# Altium project STM32F7_BaseBoard.PrjPcb
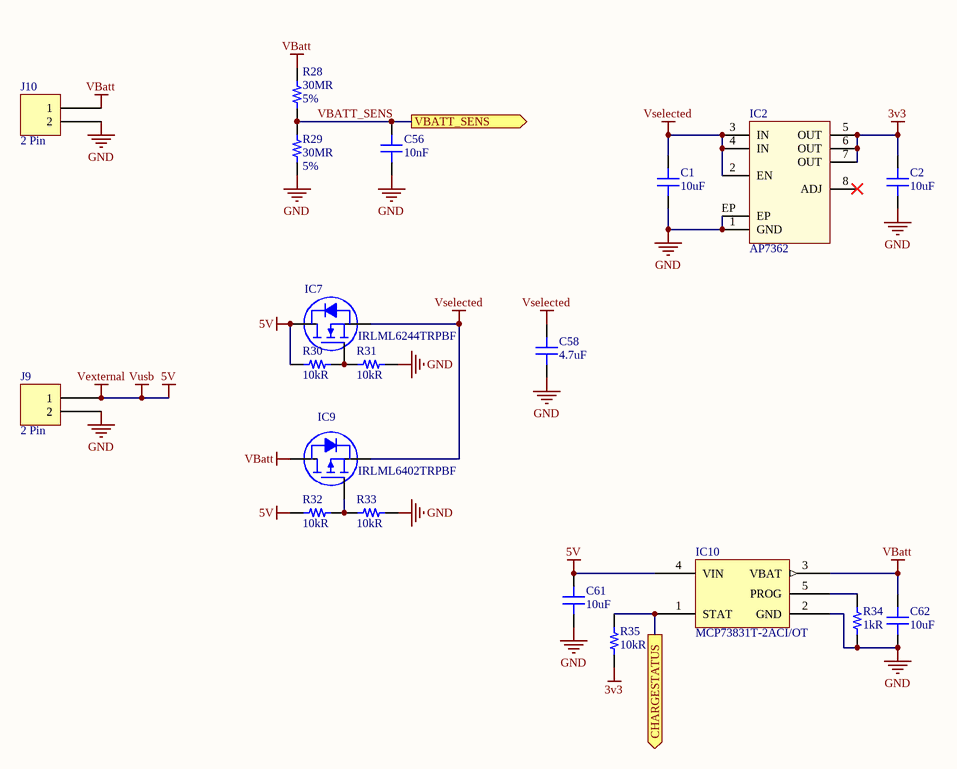
[diagram p0: Power.SchDoc]
6 sheets, 41 parts. Net scope: flat (ports and power ports of the same name join across sheets).
Board file: STM32F7_CoreBoard.PcbDoc
Sheets:
  Power.SchDoc
  QSPI FLASH.SchDoc
  Paralel NOR FLASH.SchDoc
  LCD.SchDoc
  Camera.SchDoc
  Connections.SchDoc

## Sheet Power.SchDoc: Power
size A4; SheetSize: A4

### Parts
C1  10uF  [CAP 0603/1608]
C2  10uF  [CAP 0603/1608]
C56  10nF  [CAP 0603/1608]
C58  4.7uF  [CAP 0603/1608]
C61  10uF  [CAP 0603/1608]
C62  10uF  [CAP 0603/1608]
IC2  AP7362  [DIODES SO-8-EP]
IC7  IRLML6244TRPBF  [INFINEON SOT-23-3]
IC9  IRLML6402TRPBF  [INFINEON SOT-23-3]
IC10  MCP73831T-2ACI/OT  [MICROCHIP SOT-23-5 OT]
J9  2 Pin  [JST XH B2B-XH-A]
J10  2 Pin  [JST XH B2B-XH-A]
R28  30MR  Tolerance: 5%  [RES 0603/1608]
R29  30MR  Tolerance: 5%  [RES 0603/1608]
R30  10kR  [RES 0603/1608]
R31  10kR  [RES 0603/1608]
R32  10kR  [RES 0603/1608]
R33  10kR  [RES 0603/1608]
R34  1kR  [RES 0603/1608]
R35  10kR  [RES 0603/1608]

### Ports
CHARGESTATUS (out), VBATT_SENS (out)

### Nets
3v3: C2.2 IC2.5(OUT) IC2.6(OUT) IC2.7(OUT) R35.1
5V: C61.2 IC7.3(D) IC10.4(VIN) J9.1 R30.2 R32.2  [also labelled Vexternal, Vusb]
GND: C1.1 C2.1 C56.1 C58.1 C61.1 C62.1 IC2.1(GND) IC2.EP IC10.2(GND) J9.2 J10.2 R29.1 R31.1 R33.1 R34.1
VBatt: C62.2 IC9.3(D) IC10.3(VBAT) J10.1 R28.2
Vselected: C1.2 C58.2 IC2.2(EN) IC2.3(IN) IC2.4(IN) IC7.2(S) IC9.2(S)
VBATT_SENS: C56.2 R28.1 R29.2 ; port VBATT_SENS
NetIC7_1: IC7.1(G) R30.1 R31.2
NetIC9_1: IC9.1(G) R32.1 R33.2
NetIC10_1: IC10.1(STAT) R35.2 ; port CHARGESTATUS
NetIC10_5: IC10.5(PROG) R34.2

Not connected (* = marked no-connect by the designer): IC2 8(ADJ)*

### Notes on the sheet
- Title:
- Size:
- Project:
- Revision:
- Sheet
- of
- Date:
- YıLDıZ IoT
- Elperek Mahallesi
- Saray Sokak, No:12
- SAKARYA / TURKEY
- File:

### Library data of the parts
C1 C2 C61 C62 = Capacitor - Ceramic: Ceramic, SMT Capacitor; Manufacturer: Samsung; Manufacturer Part Number: CL10A106MQ8NNNC; Tolerance: 20%; Voltage Rating: 6.3V; Dielectric: X5R; Supplier 1: Digi-Key; Supplier Part Number 1: 1276-1119-1-ND; Stock 1: 4408315; Pricing 1: 1 = 0,15000, 10 = 0,11000, 100 = 0,05150, 500 = 0,03614, 1000 = 0,02992 (USD); RoHS: Yes; Mount: Surface Mount; Case/Package: 0603; Case Code (Metric): 1608; Case Code (Imperial): 0603; Contact Plating: Tin; Min Operating Temperature: -55°C; Max Operating Temperature: 85°C; Package Quantity: 1; Packaging: Tape and Reel; Capacitance: 10uF; Voltage: 6.3V; Length: 1.6mm; Height: 0.8mm; Width: 0.031inch; Thickness: 0.035inch; Depth: 0.8mm; Radiation Hardening: No; ComponentLink1URL: https://datasheet.ciiva.com/25798/cl10a106mq8nnnc-25798320.pdf?src-supplier=Digi-Key; ComponentLink1Description: https://datasheet.ciiva.com/25798/cl10a106mq8nnnc-25798320.pdf?src-supplier=Digi-Key; ComponentLink2URL: https://datasheet.ciiva.com/26838/getdatasheetpartid-357557-26838347.pdf?src-supplier=Verical; ComponentLink2Description: https://datasheet.ciiva.com/26838/getdatasheetpartid-357557-26838347.pdf?src-supplier=Verical; ComponentLink3URL: https://datasheet.ciiva.com/16437/cl05b104kq5nnnc-16437327.pdf?src-supplier=Future+Electronics; ComponentLink3Description: https://datasheet.ciiva.com/16437/cl05b104kq5nnnc-16437327.pdf?src-supplier=Future+Electronics
C56 = Capacitor - Ceramic: Ceramic, SMT Capacitor; Manufacturer: KEMET; Manufacturer Part Number: C0603C103J5RACTU; Dielectric: X7R; Tolerance: 5%; Supplier 1: Digi-Key; Supplier Part Number 1: 399-1092-1-ND; Stock 1: 659548; Pricing 1: 1 = 0,10000, 10 = 0,05300, 100 = 0,02360, 500 = 0,01682, 1000 = 0,01322 (USD); RoHS: Yes; Mount: Surface Mount; Case/Package: 0603; Min Operating Temperature: -55°C; Max Operating Temperature: 125°C; Capacitance: 10nF; Packaging: Tape and Reel; Length: 1.6mm; Height: 0.8mm; Depth: 0.8mm; Radiation Hardening: No; ComponentLink1URL: https://datasheet.ciiva.com/22749/kem-c1002-x7r-smd-22749720.pdf?src-supplier=Element14; ComponentLink1Description: https://datasheet.ciiva.com/22749/kem-c1002-x7r-smd-22749720.pdf?src-supplier=Element14; ComponentLink2URL: https://datasheet.ciiva.com/26847/getdatasheetpartid-317400-26847516.pdf?src-supplier=Verical; ComponentLink2Description: https://datasheet.ciiva.com/26847/getdatasheetpartid-317400-26847516.pdf?src-supplier=Verical
C58 = Capacitor - Ceramic: Ceramic, SMT Capacitor; Manufacturer: Samsung; Manufacturer Part Number: CL10A475MQ8NNNC; Tolerance: 20%; Voltage Rating: 6.3V; Dielectric: X5R; Supplier 1: Digi-Key; Supplier Part Number 1: 1276-1907-1-ND; Stock 1: 764729; Pricing 1: 1 = 0,10000, 10 = 0,06300, 100 = 0,02790, 500 = 0,01990, 1000 = 0,01564 (USD); RoHS: Yes; Mount: Surface Mount; Case/Package: 0603; Case Code (Metric): 1608; Case Code (Imperial): 0603; Min Operating Temperature: -55°C; Max Operating Temperature: 85°C; Capacitance: 4.7uF; Packaging: Tape and Reel; Package Quantity: 4000; Voltage Rating (DC): 6.3V; Length: 1.6mm; Height: 0.8mm; Width: 0.031inch; Thickness: 0.035inch; Depth: 0.8mm; Radiation Hardening: No; Lead Free: Lead Free; ComponentLink1URL: https://datasheet.ciiva.com/25713/cl10a475mq8nnnc-25713301.pdf?src-supplier=Digi-Key; ComponentLink1Description: https://datasheet.ciiva.com/25713/cl10a475mq8nnnc-25713301.pdf?src-supplier=Digi-Key; ComponentLink2URL: https://datasheet.ciiva.com/26838/getdatasheetpartid-358407-26838391.pdf?src-supplier=Verical; ComponentLink2Description: https://datasheet.ciiva.com/26838/getdatasheetpartid-358407-26838391.pdf?src-supplier=Verical; ComponentLink3URL: https://datasheet.ciiva.com/16437/cl05b104kq5nnnc-16437323.pdf?src-supplier=Future+Electronics; ComponentLink3Description: https://datasheet.ciiva.com/16437/cl05b104kq5nnnc-16437323.pdf?src-supplier=Future+Electronics
IC2 = DIODES AP7362: The AP7362 is a 1.5A adjustable output voltage linear regulator with ultra-low dropout.; Manufacturer: Diodes; Manufacturer Part Number: AP7362-33SP-13; Output Voltage: 3.3V; Number of Regulators: 1; Output Type: Fixed; Polarity: Positive; Accuracy: 3.5%; Quiescent Current: 25nA; Min Input Voltage: 2.2V; Max Input Voltage: 5.5V; Supplier 1: Digi-Key; Supplier Part Number 1: AP7362-33SP-13DICT-ND; Stock 1: 2958; Pricing 1: 1 = 0,51000, 10 = 0,43600, 25 = 0,40640, 100 = 0,30200, 250 = 0,25552, 500 = 0,24392, 1000 = 0,18003 (USD); RoHS: Yes; Mount: Surface Mount; Case/Package: SOP; Number of Pins: 8; Contact Plating: Tin; Min Operating Temperature: -40°C; Max Operating Temperature: 85°C; Packaging: Tape and Reel; Output Current: 1.5A; Number of Outputs: 1; Max Output Current: 1.5A; ComponentLink1URL: http://www.mouser.com/ds/2/115/AP7362-476331.pdf?src-supplier=Mouser; ComponentLink1Description: http://www.mouser.com/ds/2/115/AP7362-476331.pdf?src-supplier=Mouser; ComponentLink2URL: https://www.diodes.com/assets/Datasheets/AP7362.pdf?src-supplier=Digi-Key; ComponentLink2Description: https://www.diodes.com/assets/Datasheets/AP7362.pdf?src-supplier=Digi-Key; ComponentLink3URL: http://diodes.com/datasheets/AP7362.pdf?src-supplier=Avnet; ComponentLink3Description: http://diodes.com/datasheets/AP7362.pdf?src-supplier=Avnet
IC7 = IRLML6244TRPBF: MOSFET N-CH 20V 6.3A SOT-23; Manufacturer: International Rectifier; Threshold Voltage: 900mV; Rds On Max: 21mR; Input Capacitance: 700pF; Max Power Dissipation: 1.3W; Gate to Source Voltage (Vgs): 12V; Turn-On Delay Time: 4.9ns; Turn-Off Delay Time: 19ns; Fall Time: 12ns; Rise Time: 7.5ns; Recovery Time: 18ns; Number of Elements: 1; Element Configuration: Single; On-State Resistance: 27MR; ComponentLink1Description: Datasheet; ComponentLink1URL: https://www.infineon.com/dgdl/irlml6244pbf.pdf?fileId=5546d462533600a4015356686fed261f; ComponentLink2Description: DigiKey Link; ComponentLink2URL: http://digikey.com/product-detail/en/infineon-technologies/IRLML6244TRPBF/IRLML6244TRPBFCT-ND/2393877; Supplier 1: Digi-Key; Supplier Part Number 1: IRLML6244TRPBFCT-ND; Manufacturer Part Number: IRLML6244TRPBF; Stock 1: 35650; Pricing 1: 1 = 0,36000, 10 = 0,29400, 25 = 0,26880, 100 = 0,16880, 250 = 0,16688, 500 = 0,15626, 1000 = 0,10625 (USD); RoHS: Yes; Mount: Surface Mount; Case/Package: SOT-23; Number of Pins: 3; Min Operating Temperature: -55°C; Max Operating Temperature: 150°C; Continuous Drain Current (ID): 6.3A; Packaging: Tape and Reel; Drain to Source Voltage (Vdss): 20V; Drain to Source Breakdown Voltage: 20V; Package Quantity: 3000; Drain to Source Resistance: 21mR; Power Dissipation: 1.3W; Nominal Vgs: 12V; Length: 3.04mm; Height: 1.02mm; Width: 1.4mm; Radiation Hardening: No; Lead Free: Lead Free; REACH SVHC: No SVHC; ComponentLink3URL: https://datasheet.ciiva.com/7935/irlml6244pbf-7935686.pdf?src-supplier=Element14; ComponentLink3Description: https://datasheet.ciiva.com/7935/irlml6244pbf-7935686.pdf?src-supplier=Element14; ComponentLink4URL: https://datasheet.ciiva.com/6369/irlml6244pbf-6369001.pdf?src-supplier=Digi-Key; ComponentLink4Description: https://datasheet.ciiva.com/6369/irlml6244pbf-6369001.pdf?src-supplier=Digi-Key; ComponentLink5URL: https://datasheet.ciiva.com/6369/irlml6244pbf-6369003.pdf?src-supplier=Digi-Key; ComponentLink5Description: https://datasheet.ciiva.com/6369/irlml6244pbf-6369003.pdf?src-supplier=Digi-Key; ComponentLink6URL: https://datasheet.ciiva.com/6369/irlml6244pbf-6369005.pdf?src-supplier=Digi-Key; ComponentLink6Description: https://datasheet.ciiva.com/6369/irlml6244pbf-6369005.pdf?src-supplier=Digi-Key; ComponentLink7URL: https://datasheet.ciiva.com/29325/161189-da-01-en-mosfet-irlml6244trpbf-sot23-ir-29325543.pdf?src-supplier=Conrad; ComponentLink7Description: https://datasheet.ciiva.com/29325/161189-da-01-en-mosfet-irlml6244trpbf-sot23-ir-29325543.pdf?src-supplier=Conrad
IC9 = IRLML6402TRPBF: MOSFET P-CH 20V 3.7A SOT-23; Manufacturer: International Rectifier; Gate to Source Voltage (Vgs): 12V; Drain to Source Resistance: 65mR; Power Dissipation: 1.3W; Turn-On Delay Time: 350ns; Turn-Off Delay Time: 588ns; Fall Time: 381ns; Voltage Rating (DC): -20V; Current Rating: -3.7A; Threshold Voltage: -550mV; Rise Time: 48ns; Input Capacitance: 633pF; Number of Elements: 1; Element Configuration: Single; ComponentLink1Description: Datasheet; ComponentLink1URL: https://www.infineon.com/dgdl/irlml6402pbf.pdf?fileId=5546d462533600a401535668d5c2263c; ComponentLink2Description: DigiKey Link; ComponentLink2URL: http://digikey.com/product-detail/en/infineon-technologies/IRLML6402TRPBF/IRLML6402PBFCT-ND/812500; Supplier 1: Digi-Key; Supplier Part Number 1: IRLML6402PBFCT-ND; Manufacturer Part Number: IRLML6402TRPBF; Stock 1: 132544; Pricing 1: 1 = 0,36000, 10 = 0,28800, 25 = 0,26360, 100 = 0,16550, 250 = 0,16368, 500 = 0,15326, 1000 = 0,10421 (USD); RoHS: Yes; Mount: Surface Mount; Case/Package: SOT-23; Number of Pins: 3; Min Operating Temperature: -55°C; Max Operating Temperature: 150°C; Drain to Source Voltage (Vdss): 20V; Continuous Drain Current (ID): 3.7A; Termination: SMD/SMT; Package Quantity: 1; On-State Resistance: 65mR; Packaging: Tape and Reel; Nominal Vgs: -550mV; Rds On Max: 65mR; Max Power Dissipation: 1.3W; Dual Supply Voltage: -20V; Drain to Source Breakdown Voltage: -20V; Length: 3.04mm; Height: 1.02mm; Width: 1.4mm; Radiation Hardening: No; Lead Free: Lead Free; REACH SVHC: No SVHC; ComponentLink3URL: https://datasheet.ciiva.com/34302/1563729-34302500.pdf?src-supplier=Jameco; ComponentLink3Description: https://datasheet.ciiva.com/34302/1563729-34302500.pdf?src-supplier=Jameco; ComponentLink4URL: https://datasheet.ciiva.com/7333/irlml6402-7333200.pdf?src-supplier=Newark; ComponentLink4Description: https://datasheet.ciiva.com/7333/irlml6402-7333200.pdf?src-supplier=Newark; ComponentLink5URL: https://datasheet.ciiva.com/28515/irlml6402pbf-28515795.pdf?src-supplier=Element14; ComponentLink5Description: https://datasheet.ciiva.com/28515/irlml6402pbf-28515795.pdf?src-supplier=Element14; ComponentLink6URL: https://datasheet.ciiva.com/7799/13209-7799017.pdf?src-supplier=Element14; ComponentLink6Description: https://datasheet.ciiva.com/7799/13209-7799017.pdf?src-supplier=Element14; ComponentLink7URL: https://datasheet.ciiva.com/29326/162833-da-01-en-irlml-6402tr-29326798.pdf?src-supplier=Conrad; ComponentLink7Description: https://datasheet.ciiva.com/29326/162833-da-01-en-irlml-6402tr-29326798.pdf?src-supplier=Conrad; ComponentLink8URL: https://datasheet.ciiva.com/936/irlml6402pbf-936987.pdf?src-supplier=Digi-Key; ComponentLink8Description: https://datasheet.ciiva.com/936/irlml6402pbf-936987.pdf?src-supplier=Digi-Key; ComponentLink9URL: https://datasheet.ciiva.com/16311/irlml6402pbf-16311535.pdf?src-supplier=Future+Electronics; ComponentLink9Description: https://datasheet.ciiva.com/16311/irlml6402pbf-16311535.pdf?src-supplier=Future+Electronics
IC10 = MICROCHIP MCP73831: Miniature Single-Cell, Fully integrated Li-Ion, Li-Polymer charge management controllers; Supplier 1: Digi-Key; Supplier Part Number 1: MCP73831T-2ACI/OTCT-ND; Manufacturer: Microchip; Manufacturer Part Number: MCP73831T-2ACI/OT; Stock 1: 29869; Pricing 1: 1 = 0,56000, 25 = 0,47000, 100 = 0,42000 (USD); RoHS: Yes; ComponentLink1URL: https://datasheet.ciiva.com/22828/0900766b80d2b53a-22828876.pdf?src-supplier=RSComponents; ComponentLink1Description: https://datasheet.ciiva.com/22828/0900766b80d2b53a-22828876.pdf?src-supplier=RSComponents; ComponentLink2URL: https://datasheet.ciiva.com/26344/651521-da-01-en-contr-mcp73831t-2aci-ot-sot-23-5-mcp-26344458.pdf?src-supplier=Conrad; ComponentLink2Description: https://datasheet.ciiva.com/26344/651521-da-01-en-contr-mcp73831t-2aci-ot-sot-23-5-mcp-26344458.pdf?src-supplier=Conrad; ComponentLink3URL: https://datasheet.ciiva.com/1931/21984e-1931953.pdf?src-supplier=Digi-Key; ComponentLink3Description: https://datasheet.ciiva.com/1931/21984e-1931953.pdf?src-supplier=Digi-Key; ComponentLink4URL: https://datasheet.ciiva.com/1931/21984e-1931954.pdf?src-supplier=Digi-Key; ComponentLink4Description: https://datasheet.ciiva.com/1931/21984e-1931954.pdf?src-supplier=Digi-Key; ComponentLink5URL: https://datasheet.ciiva.com/1137/630369-1137803.pdf?src-supplier=Element14; ComponentLink5Description: https://datasheet.ciiva.com/1137/630369-1137803.pdf?src-supplier=Element14; ComponentLink6URL: https://datasheet.ciiva.com/1144/630369-1144461.pdf?src-supplier=Newark; ComponentLink6Description: https://datasheet.ciiva.com/1144/630369-1144461.pdf?src-supplier=Newark; ComponentLink7URL: https://datasheet.ciiva.com/1931/21984e-1931955.pdf?src-supplier=Digi-Key; ComponentLink7Description: https://datasheet.ciiva.com/1931/21984e-1931955.pdf?src-supplier=Digi-Key; ComponentLink8URL: https://datasheet.ciiva.com/28626/630369-28626439.pdf?src-supplier=Element14; ComponentLink8Description: https://datasheet.ciiva.com/28626/630369-28626439.pdf?src-supplier=Element14; ComponentLink9URL: https://datasheet.ciiva.com/3213/21984e-3213404.pdf?src-supplier=Avnet; ComponentLink9Description: https://datasheet.ciiva.com/3213/21984e-3213404.pdf?src-supplier=Avnet; ComponentLink10URL: https://datasheet.ciiva.com/46385/630369-46385324.pdf?src-supplier=Element14; ComponentLink10Description: https://datasheet.ciiva.com/46385/630369-46385324.pdf?src-supplier=Element14
R28 R29 = Resistor_Chip: Ceramic, SMT Capacitor; Manufacturer: Vishay Dale; Manufacturer Part Number: CRCW060330M0JPEAHR; Max Power Dissipation: 100mW; Temperature Coefficient: 500ppm/°C; Supplier 1: Digi-Key; Supplier Part Number 1: 541-30MAHCT-ND; Stock 1: 39597; Pricing 1: 1 = 0,40000, 10 = 0,28500, 100 = 0,11390, 1000 = 0,05610, 2500 = 0,05198 (USD); RoHS: Yes; Case/Package: 0603; Case Code (Imperial): 0603; Contact Plating: Tin; Case Code (Metric): 1608; Min Operating Temperature: -55°C; Max Operating Temperature: 155°C; Resistance: 30MR; Package Quantity: 5000; Packaging: Tape and Reel; Composition: Thick Film; Number of Terminations: 2; Length: 0.061inch; Height: 0.02inch; Width: 0.033inch; Radiation Hardening: No; ComponentLink1URL: https://datasheet.ciiva.com/6566/dcrcwhe3-6566118.pdf?src-supplier=Digi-Key; ComponentLink1Description: https://datasheet.ciiva.com/6566/dcrcwhe3-6566118.pdf?src-supplier=Digi-Key; ComponentLink2URL: https://datasheet.ciiva.com/6566/dcrcwhe3-6566121.pdf?src-supplier=Digi-Key; ComponentLink2Description: https://datasheet.ciiva.com/6566/dcrcwhe3-6566121.pdf?src-supplier=Digi-Key; ComponentLink3URL: https://datasheet.ciiva.com/6566/dcrcwhe3-6566124.pdf?src-supplier=Digi-Key; ComponentLink3Description: https://datasheet.ciiva.com/6566/dcrcwhe3-6566124.pdf?src-supplier=Digi-Key
R30-R33 R35 = Resistor_Chip: Ceramic, SMT Capacitor; Manufacturer: Stackpole Electronics; Manufacturer Part Number: RNCP0603FTD10K0; Tolerance: 1%; Max Power Dissipation: 125mW; Temperature Coefficient: 100ppm/°C; Supplier 1: Digi-Key; Supplier Part Number 1: RNCP0603FTD10K0CT-ND; Stock 1: 183083; Pricing 1: 1 = 0,10000, 10 = 0,06700, 100 = 0,02730, 1000 = 0,01224, 2500 = 0,01063 (USD); RoHS: Yes; Mount: Surface Mount; Case/Package: 0603; Case Code (Metric): 1608; Case Code (Imperial): 0603; Contact Plating: Matte,Tin; Min Operating Temperature: -55°C; Max Operating Temperature: 155°C; Packaging: Tape and Reel; Resistance: 10kR; Composition: Thin Film; Number of Terminations: 2; Features: Anti-Sulfur,Moisture Resistant; Length: 0.059inch; Height: 0.02inch; Width: 0.031inch; Radiation Hardening: No; Lead Free: Lead Free
R34 = Resistor_Chip: Ceramic, SMT Capacitor; Manufacturer: Rohm; Manufacturer Part Number: ESR03EZPJ102; Tolerance: 5%; Temperature Coefficient: 200ppm/°C; Max Power Dissipation: 250mW; Supplier 1: Digi-Key; Supplier Part Number 1: RHM1.0KDCT-ND; Stock 1: 148117; Pricing 1: 1 = 0,10000, 10 = 0,08300, 100 = 0,03180, 1000 = 0,01398, 2500 = 0,01207 (USD); RoHS: Yes; Case/Package: 0603; Case Code (Metric): 1608; Case Code (Imperial): 0603; Min Operating Temperature: -55°C; Max Operating Temperature: 155°C; Resistance: 1kR; Package Quantity: 1; Packaging: Tape and Reel; Composition: Thick Film; Number of Terminations: 2; Features: Automotive AEC-Q200; Length: 0.063inch; Height: 0.022inch; Width: 0.031inch; Lead Free: Lead Free; ComponentLink1URL: https://datasheet.ciiva.com/2469/esr-2469603.pdf?src-supplier=Digi-Key; ComponentLink1Description: https://datasheet.ciiva.com/2469/esr-2469603.pdf?src-supplier=Digi-Key; ComponentLink2URL: https://datasheet.ciiva.com/2469/esr-2469604.pdf?src-supplier=Digi-Key; ComponentLink2Description: https://datasheet.ciiva.com/2469/esr-2469604.pdf?src-supplier=Digi-Key; ComponentLink3URL: https://datasheet.ciiva.com/2469/esr-2469605.pdf?src-supplier=Digi-Key; ComponentLink3Description: https://datasheet.ciiva.com/2469/esr-2469605.pdf?src-supplier=Digi-Key

## Sheet QSPI FLASH.SchDoc: QSPI FLASH
size A4; SheetNumber: 2; SheetSize: A4; Time: 11
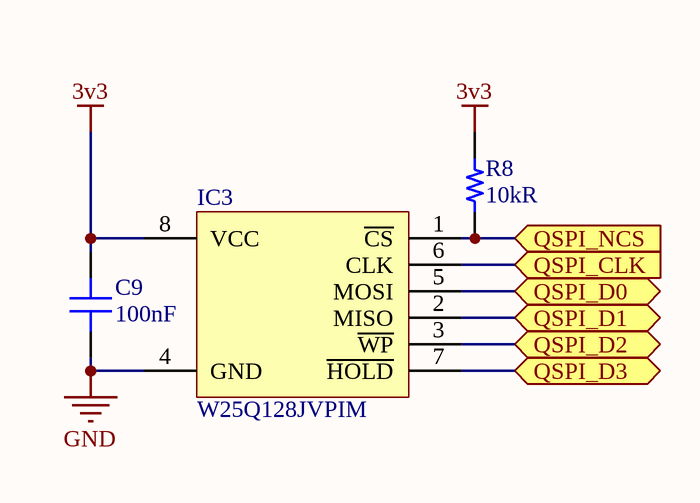
[diagram p1: QSPI FLASH.SchDoc]

### Parts
C9  100nF  [CAP 0603/1608]
IC3  W25Q128JVPIM  [WINBOND WSON-8 6x5mm]
R8  10kR  [RES 0603/1608]

### Ports
QSPI_CLK (in), QSPI_D0 (bidir), QSPI_D1 (bidir), QSPI_D2 (bidir), QSPI_D3 (bidir), QSPI_NCS (in)

### Nets
3v3: C9.1 IC3.8(VCC) R8.2
GND: C9.2 IC3.4(GND)
NetIC3_1: IC3.1(~{CS}) R8.1 ; port QSPI_NCS
NetIC3_2: IC3.2(MISO) ; port QSPI_D1
NetIC3_3: IC3.3(~{WP}) ; port QSPI_D2
NetIC3_5: IC3.5(MOSI) ; port QSPI_D0
NetIC3_6: IC3.6(CLK) ; port QSPI_CLK
NetIC3_7: IC3.7(~{HOLD}) ; port QSPI_D3

### Notes on the sheet
- Title:
- Size:
- Project:
- Revision:
- Sheet
- of
- Date:
- YıLDıZ IoT
- Elperek Mahallesi
- Saray Sokak, No:12
- SAKARYA / TURKEY
- File:

### Library data of the parts
C9 = Capacitor - Ceramic: Ceramic, SMT Capacitor; Manufacturer: Samsung; Manufacturer Part Number: CL10B104JB8NNNC; Tolerance: 5%; Voltage Rating: 50V; Dielectric: X7R; Supplier 1: Digi-Key; Supplier Part Number 1: 1276-1033-1-ND; Stock 1: 305374; Pricing 1: 1 = 0,10000, 10 = 0,04800, 100 = 0,02160, 500 = 0,01540, 1000 = 0,01210 (USD); RoHS: Yes; Mount: Surface Mount; Case/Package: 0603; Case Code (Metric): 1608; Case Code (Imperial): 0603; Material: Ceramic; Contact Plating: Tin; Min Operating Temperature: -55°C; Max Operating Temperature: 125°C; Packaging: Tape and Reel; Package Quantity: 1; Capacitance: 100nF; Voltage: 50V; Length: 1.6mm; Height: 0.8mm; Width: 0.031inch; Thickness: 0.035inch; Depth: 0.8mm; Radiation Hardening: No; ComponentLink1URL: https://datasheet.ciiva.com/25793/cl10b104jb8nnnc-25793394.pdf?src-supplier=Digi-Key; ComponentLink1Description: https://datasheet.ciiva.com/25793/cl10b104jb8nnnc-25793394.pdf?src-supplier=Digi-Key; ComponentLink2URL: https://datasheet.ciiva.com/26838/getdatasheetpartid-359321-26838402.pdf?src-supplier=Verical; ComponentLink2Description: https://datasheet.ciiva.com/26838/getdatasheetpartid-359321-26838402.pdf?src-supplier=Verical; ComponentLink3URL: https://datasheet.ciiva.com/16498/cl10b104jb8nnnc-16498485.pdf?src-supplier=Future+Electronics; ComponentLink3Description: https://datasheet.ciiva.com/16498/cl10b104jb8nnnc-16498485.pdf?src-supplier=Future+Electronics; ComponentLink4URL: https://datasheet.ciiva.com/29199/456613-da-01-en-vs-kondensator-0603-29199008.pdf?src-supplier=Conrad; ComponentLink4Description: https://datasheet.ciiva.com/29199/456613-da-01-en-vs-kondensator-0603-29199008.pdf?src-supplier=Conrad
IC3 = WINBOND FLASH SPI 8PIN: Supplier 1: Digi-Key; Supplier Part Number 1: W25Q128JVPIM-ND; Manufacturer: Winbond; Manufacturer Part Number: W25Q128JVPIM; Stock 1: 3127; Pricing 1: 1 = 1,47000, 10 = 1,34200, 25 = 1,30640, 50 = 1,29940, 100 = 1,16150, 250 = 1,15808, 500 = 1,14084, 1000 = 1,09189, 5000 = 1,01675 (USD); RoHS: No; ComponentLink1URL: http://www.winbond.com/resource-files/w25q128jv_dtr%20revc%2003272018%20plus.pdf?src-supplier=Digi-Key; ComponentLink1Description: http://www.winbond.com/resource-files/w25q128jv_dtr%20revc%2003272018%20plus.pdf?src-supplier=Digi-Key
R8 = Resistor_Chip: as R30 on sheet Power; Supplier 1: Digi-Key; Supplier Part Number 1: RNCP0603FTD10K0CT-ND; Stock 1: 619664; Pricing 1: 1 = 0,10000, 10 = 0,06700, 100 = 0,02730, 1000 = 0,01224, 2500 = 0,01063 (USD); RoHS: Yes; Mount: Surface Mount; Case/Package: 0603; Case Code (Metric): 1608; Case Code (Imperial): 0603; Contact Plating: Tin,Matte; Min Operating Temperature: -55°C; Max Operating Temperature: 155°C; Packaging: Tape and Reel; Resistance: 10kR; Composition: Thin Film; Number of Terminations: 2; Features: Moisture Resistant,Anti-Sulfur; Length: 0.059inch; Height: 0.02inch; Width: 0.031inch; Radiation Hardening: No; Lead Free: Lead Free; ComponentLink1URL: https://www.seielect.com/Catalog/SEI-rncp.pdf?src-supplier=Avnet; ComponentLink1Description: https://www.seielect.com/Catalog/SEI-rncp.pdf?src-supplier=Avnet; ComponentLink2URL: https://www.seielect.com/catalog/SEI-Packaging.pdf?src-supplier=Digi-Key; ComponentLink2Description: https://www.seielect.com/catalog/SEI-Packaging.pdf?src-supplier=Digi-Key; ComponentLink3URL: https://www.seielect.com/Catalog/SEI-rncp.pdf?src-supplier=Digi-Key; ComponentLink3Description: https://www.seielect.com/Catalog/SEI-rncp.pdf?src-supplier=Digi-Key

## Sheet Paralel NOR FLASH.SchDoc: Paralel NOR FLASH
size A4; SheetNumber: 3; SheetTotal: 11; SheetSize: A4
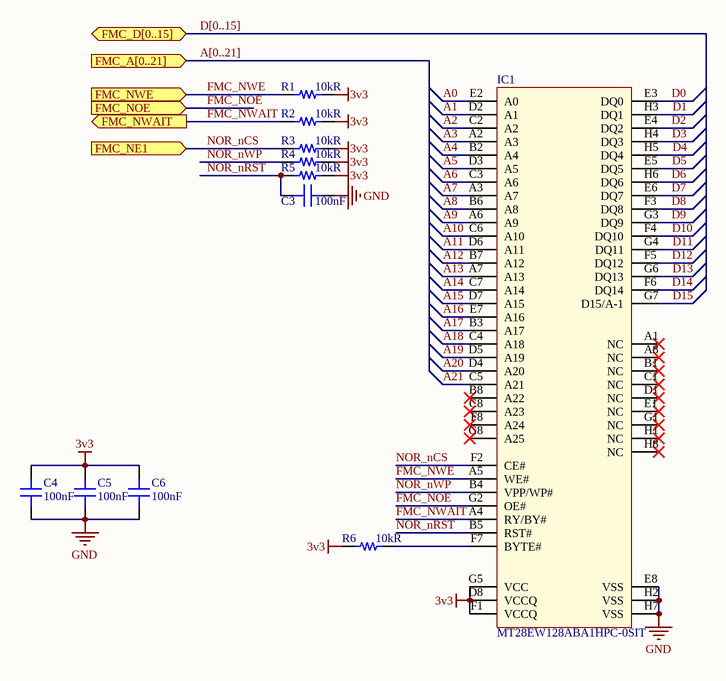
[diagram p2: Paralel NOR FLASH.SchDoc]

### Parts
C3  100nF  [CAP 0603/1608]
C4  100nF  [CAP 0603/1608]
C5  100nF  [CAP 0603/1608]
C6  100nF  [CAP 0603/1608]
IC1  MT28EW128ABA1HPC-0SIT  [MICRON LBGA-64 11X13mm]
R1  10kR  [RES 0603/1608]
R2  10kR  [RES 0603/1608]
R3  10kR  [RES 0603/1608]
R4  10kR  [RES 0603/1608]
R5  10kR  [RES 0603/1608]
R6  10kR  [RES 0603/1608]

### Ports
FMC_A[0..21] (in), FMC_D[0..15] (bidir), FMC_NE1 (in), FMC_NOE (in), FMC_NWAIT (out), FMC_NWE (in)

### Nets
3v3: C4.1 C5.1 C6.1 IC1.D8(VCCQ) IC1.F1(VCCQ) IC1.G5(VCC) R1.2 R2.2 R3.2 R4.2 R5.2 R6.1
GND: C3.2 C4.2 C5.2 C6.2 IC1.E8(VSS) IC1.H2(VSS) IC1.H7(VSS)
A0: IC1.E2(A0)
A1: IC1.D2(A1)
A2: IC1.C2(A2)
A3: IC1.A2(A3)
A4: IC1.B2(A4)
A5: IC1.D3(A5)
A6: IC1.C3(A6)
A7: IC1.A3(A7)
A8: IC1.B6(A8)
A9: IC1.A6(A9)
A10: IC1.C6(A10)
A11: IC1.D6(A11)
A12: IC1.B7(A12)
A13: IC1.A7(A13)
A14: IC1.C7(A14)
A15: IC1.D7(A15)
A16: IC1.E7(A16)
A17: IC1.B3(A17)
A18: IC1.C4(A18)
A19: IC1.D5(A19)
A20: IC1.D4(A20)
A21: IC1.C5(A21)
D0: IC1.E3(DQ0)
D1: IC1.H3(DQ1)
D2: IC1.E4(DQ2)
D3: IC1.H4(DQ3)
D4: IC1.H5(DQ4)
D5: IC1.E5(DQ5)
D6: IC1.H6(DQ6)
D7: IC1.E6(DQ7)
D8: IC1.F3(DQ8)
D9: IC1.G3(DQ9)
D10: IC1.F4(DQ10)
D11: IC1.G4(DQ11)
D12: IC1.F5(DQ12)
D13: IC1.G6(DQ13)
D14: IC1.F6(DQ14)
D15: IC1.G7(D15/A-1)
FMC_NOE: IC1.G2(OE#) ; port FMC_NOE
FMC_NWAIT: IC1.A4(RY/BY#) R2.1 ; port FMC_NWAIT
FMC_NWE: IC1.A5(WE#) R1.1 ; port FMC_NWE
NOR_nCS: IC1.F2(CE#) R3.1 ; port FMC_NE1
NOR_nRST: C3.1 IC1.B5(RST#) R5.1
NOR_nWP: IC1.B4(VPP/WP#) R4.1
NetIC1_F7: IC1.F7(BYTE#) R6.2

Not connected (* = marked no-connect by the designer): IC1 A1(NC)* A8(NC)* B1(NC)* B8(A22)* C1(NC)* C8(A23)* D1(NC)* E1(NC)* F8(A24)* G1(NC)* G8(A25)* H1(NC)* H8(NC)*

### Buses and harness runs
bus A[0..21] = port FMC_A[0..21]
bus D[0..15] = port FMC_D[0..15]

### Notes on the sheet
- Title:
- Size:
- Project:
- Revision:
- Sheet
- of
- Date:
- YıLDıZ IoT
- Elperek Mahallesi
- Saray Sokak, No:12
- SAKARYA / TURKEY
- File:

### Library data of the parts
C3-C6 = Capacitor - Ceramic: as C9 on sheet QSPI FLASH; Supplier 1: Digi-Key; Supplier Part Number 1: 1276-1033-1-ND; Stock 1: 305374; Pricing 1: 1 = 0,10000, 10 = 0,04800, 100 = 0,02160, 500 = 0,01540, 1000 = 0,01210 (USD); RoHS: Yes; Mount: Surface Mount; Case/Package: 0603; Case Code (Metric): 1608; Case Code (Imperial): 0603; Material: Ceramic; Contact Plating: Tin; Min Operating Temperature: -55°C; Max Operating Temperature: 125°C; Packaging: Tape and Reel; Package Quantity: 1; Capacitance: 100nF; Voltage: 50V; Length: 1.6mm; Height: 0.8mm; Width: 0.031inch; Thickness: 0.035inch; Depth: 0.8mm; Radiation Hardening: No; ComponentLink1URL: https://datasheet.ciiva.com/25793/cl10b104jb8nnnc-25793394.pdf?src-supplier=Digi-Key; ComponentLink1Description: https://datasheet.ciiva.com/25793/cl10b104jb8nnnc-25793394.pdf?src-supplier=Digi-Key; ComponentLink2URL: https://datasheet.ciiva.com/26838/getdatasheetpartid-359321-26838402.pdf?src-supplier=Verical; ComponentLink2Description: https://datasheet.ciiva.com/26838/getdatasheetpartid-359321-26838402.pdf?src-supplier=Verical; ComponentLink3URL: https://datasheet.ciiva.com/16498/cl10b104jb8nnnc-16498485.pdf?src-supplier=Future+Electronics; ComponentLink3Description: https://datasheet.ciiva.com/16498/cl10b104jb8nnnc-16498485.pdf?src-supplier=Future+Electronics; ComponentLink4URL: https://datasheet.ciiva.com/29199/456613-da-01-en-vs-kondensator-0603-29199008.pdf?src-supplier=Conrad; ComponentLink4Description: https://datasheet.ciiva.com/29199/456613-da-01-en-vs-kondensator-0603-29199008.pdf?src-supplier=Conrad
IC1 = MICRON MT28EW128: Parallel NOR Flash Embedded Memory; Manufacturer: Micron Technology; Memory Type: Non-Volatile,FLASH; Memory Size: 128Mb; Access Time: 95ns; Supplier 1: Digi-Key; Supplier Part Number 1: 557-1777-ND; Manufacturer Part Number: MT28EW128ABA1HPC-0SIT; Stock 1: 1436; Pricing 1: 1 = 3,60000, 10 = 3,26400, 25 = 3,19320, 50 = 3,17540, 100 = 2,84780, 250 = 2,83716, 500 = 2,73266, 1000 = 2,59806 (USD); RoHS: Yes; Mount: Surface Mount; Number of Pins: 64; Min Operating Temperature: -40°C; Max Operating Temperature: 85°C; Packaging: Tray; ComponentLink1URL: https://www.micron.com/~/media/documents/products/data-sheet/nor-flash/parallel/mt28ew_mt28fw/mt28ew_qlhp_128_aba_0sit.pdf?src-supplier=Digi-Key; ComponentLink1Description: https://www.micron.com/~/media/documents/products/data-sheet/nor-flash/parallel/mt28ew_mt28fw/mt28ew_qlhp_128_aba_0sit.pdf?src-supplier=Digi-Key
R1-R6 = Resistor_Chip: as R30 on sheet Power; Supplier 1: Digi-Key; Supplier Part Number 1: RNCP0603FTD10K0CT-ND; Stock 1: 619664; Pricing 1: 1 = 0,10000, 10 = 0,06700, 100 = 0,02730, 1000 = 0,01224, 2500 = 0,01063 (USD); RoHS: Yes; Mount: Surface Mount; Case/Package: 0603; Case Code (Metric): 1608; Case Code (Imperial): 0603; Contact Plating: Tin,Matte; Min Operating Temperature: -55°C; Max Operating Temperature: 155°C; Packaging: Tape and Reel; Resistance: 10kR; Composition: Thin Film; Number of Terminations: 2; Features: Moisture Resistant,Anti-Sulfur; Length: 0.059inch; Height: 0.02inch; Width: 0.031inch; Radiation Hardening: No; Lead Free: Lead Free; ComponentLink1URL: https://www.seielect.com/Catalog/SEI-rncp.pdf?src-supplier=Avnet; ComponentLink1Description: https://www.seielect.com/Catalog/SEI-rncp.pdf?src-supplier=Avnet; ComponentLink2URL: https://www.seielect.com/catalog/SEI-Packaging.pdf?src-supplier=Digi-Key; ComponentLink2Description: https://www.seielect.com/catalog/SEI-Packaging.pdf?src-supplier=Digi-Key; ComponentLink3URL: https://www.seielect.com/Catalog/SEI-rncp.pdf?src-supplier=Digi-Key; ComponentLink3Description: https://www.seielect.com/Catalog/SEI-rncp.pdf?src-supplier=Digi-Key

## Sheet LCD.SchDoc: 24 Bit TFT LCD
size A4; SheetNumber: 7; SheetTotal: 11; SheetSize: A4
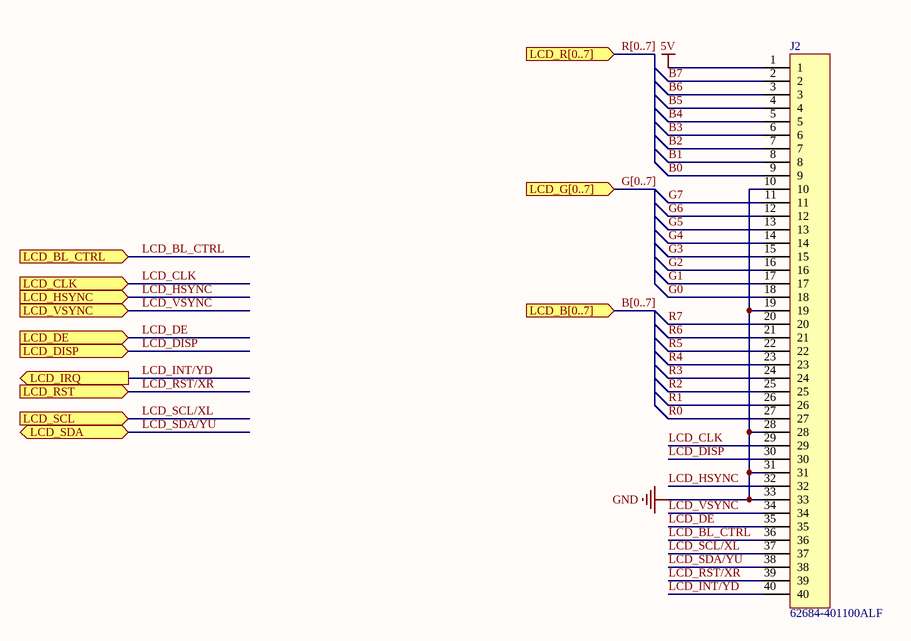
[diagram p3: LCD.SchDoc]

### Parts
J2  62684-401100ALF  [fpc-40]

### Ports
LCD_B[0..7] (in), LCD_BL_CTRL (in), LCD_CLK (in), LCD_DE (in), LCD_DISP (in), LCD_G[0..7] (in), LCD_HSYNC (in), LCD_IRQ (out), LCD_R[0..7] (in), LCD_RST (in), LCD_SCL (in), LCD_SDA (bidir), LCD_VSYNC (in)

### Nets
5V: J2.1
GND: J2.10 J2.19 J2.28 J2.31 J2.33
B0: J2.9
B1: J2.8
B2: J2.7
B3: J2.6
B4: J2.5
B5: J2.4
B6: J2.3
B7: J2.2
G0: J2.18
G1: J2.17
G2: J2.16
G3: J2.15
G4: J2.14
G5: J2.13
G6: J2.12
G7: J2.11
LCD_BL_CTRL: J2.36 ; port LCD_BL_CTRL
LCD_CLK: J2.29 ; port LCD_CLK
LCD_DE: J2.35 ; port LCD_DE
LCD_DISP: J2.30 ; port LCD_DISP
LCD_HSYNC: J2.32 ; port LCD_HSYNC
LCD_INT/YD: J2.40 ; port LCD_IRQ
LCD_RST/XR: J2.39 ; port LCD_RST
LCD_SCL/XL: J2.37 ; port LCD_SCL
LCD_SDA/YU: J2.38 ; port LCD_SDA
LCD_VSYNC: J2.34 ; port LCD_VSYNC
R0: J2.27
R1: J2.26
R2: J2.25
R3: J2.24
R4: J2.23
R5: J2.22
R6: J2.21
R7: J2.20

### Buses and harness runs
bus B[0..7] = port LCD_B[0..7]
bus G[0..7] = port LCD_G[0..7]
bus R[0..7] = port LCD_R[0..7]

### Notes on the sheet
- Title:
- Size:
- Project:
- Revision:
- Sheet
- of
- Date:
- YıLDıZ IoT
- Elperek Mahallesi
- Saray Sokak, No:12
- SAKARYA / TURKEY
- File:

### Library data of the parts
J2 = FPC-40: Connector; Manufacturer: Amphenol FCI; Actuator Material: Glass,Thermoplastic; Number of Positions: 40; Current Rating: 500mA; Voltage Rating: 50V; Contact Location: Bottom; Insulation Resistance: 100MR; Gender: Receptacle; Contact Resistance: 30mR; Pitch: 0.5mm; Supplier 1: Digi-Key; Supplier Part Number 1: 609-1195-1-ND; Manufacturer Part Number: 62684-401100ALF; Stock 1: 13351; Pricing 1: 1 = 0,97000, 10 = 0,85600, 25 = 0,80600, 50 = 0,77240, 100 = 0,73880, 250 = 0,67168, 500 = 0,60450, 1000 = 0,53733 (USD); RoHS: Yes; Mount: Surface Mount; Housing Material: Thermoplastic; Housing Color: Beige; Contact Material: Bronze; Contact Plating: Gold; Min Operating Temperature: -55°C; Max Operating Temperature: 85°C; Termination: Solder; Packaging: Tape and Reel; Orientation: Right Angle; Number of Contacts: 40; Max Voltage Rating (AC): 50V; Max Voltage Rating (DC): 50V; Number of Rows: 1; Package Quantity: 2000; Length: 25.5mm; Depth: 5mm; Width: 5mm; Flammability Rating: UL94 V-0; REACH SVHC: No SVHC; Lead Free: Lead Free; ComponentLink1URL: https://datasheet.ciiva.com/25631/0900766b8118e51f-25631168.pdf?src-supplier=RSComponents; ComponentLink1Description: https://datasheet.ciiva.com/25631/0900766b8118e51f-25631168.pdf?src-supplier=RSComponents; ComponentLink2URL: https://datasheet.ciiva.com/3112/62684-3112007.pdf?src-supplier=Avnet; ComponentLink2Description: https://datasheet.ciiva.com/3112/62684-3112007.pdf?src-supplier=Avnet; ComponentLink3URL: https://datasheet.ciiva.com/670/62684-670200.pdf?src-supplier=Digi-Key; ComponentLink3Description: https://datasheet.ciiva.com/670/62684-670200.pdf?src-supplier=Digi-Key; ComponentLink4URL: https://datasheet.ciiva.com/670/62684-670201.pdf?src-supplier=Digi-Key; ComponentLink4Description: https://datasheet.ciiva.com/670/62684-670201.pdf?src-supplier=Digi-Key; ComponentLink5URL: https://datasheet.ciiva.com/670/62684-670202.pdf?src-supplier=Digi-Key; ComponentLink5Description: https://datasheet.ciiva.com/670/62684-670202.pdf?src-supplier=Digi-Key; ComponentLink6URL: https://datasheet.ciiva.com/16659/62684-16659882.pdf?src-supplier=Avnet+Europe; ComponentLink6Description: https://datasheet.ciiva.com/16659/62684-16659882.pdf?src-supplier=Avnet+Europe; ComponentLink7URL: https://datasheet.ciiva.com/16709/70236840-16709916.pdf?src-supplier=Allied+Electronics; ComponentLink7Description: https://datasheet.ciiva.com/16709/70236840-16709916.pdf?src-supplier=Allied+Electronics; ComponentLink8URL: https://datasheet.ciiva.com/3112/62684-3112397.pdf?src-supplier=Avnet; ComponentLink8Description: https://datasheet.ciiva.com/3112/62684-3112397.pdf?src-supplier=Avnet; ComponentLink9URL: https://datasheet.ciiva.com/5772/62684-5772782.pdf?src-supplier=Farnell; ComponentLink9Description: https://datasheet.ciiva.com/5772/62684-5772782.pdf?src-supplier=Farnell

## Sheet Camera.SchDoc: 8 Bit Camera
size A4; SheetSize: A4
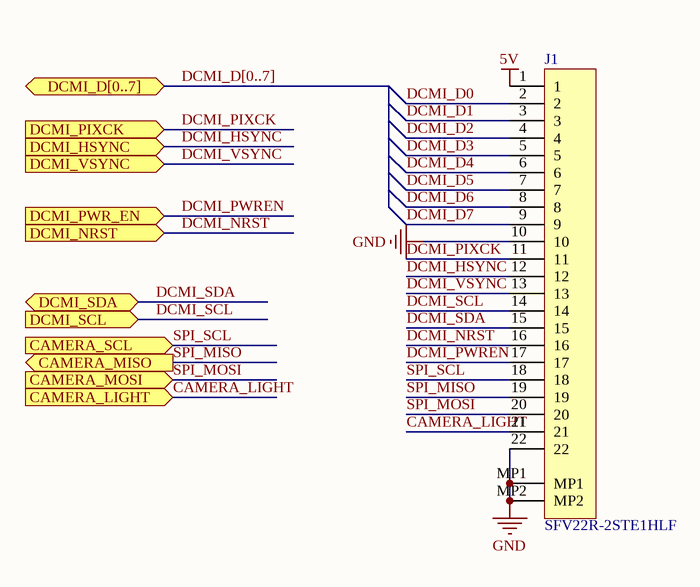
[diagram p4: Camera.SchDoc]

### Parts
J1  SFV22R-2STE1HLF  [fpc-22]

### Ports
CAMERA_LIGHT (in), CAMERA_MISO (out), CAMERA_MOSI (in), CAMERA_SCL (in), DCMI_D[0..7] (bidir), DCMI_HSYNC (in), DCMI_NRST (in), DCMI_PIXCK (in), DCMI_PWR_EN (in), DCMI_SCL (in), DCMI_SDA (bidir), DCMI_VSYNC (in)

### Nets
5V: J1.1
GND: J1.10 J1.22 J1.MP1 J1.MP2
CAMERA_LIGHT: J1.21 ; port CAMERA_LIGHT
DCMI_D0: J1.2
DCMI_D1: J1.3
DCMI_D2: J1.4
DCMI_D3: J1.5
DCMI_D4: J1.6
DCMI_D5: J1.7
DCMI_D6: J1.8
DCMI_D7: J1.9
DCMI_HSYNC: J1.12 ; port DCMI_HSYNC
DCMI_NRST: J1.16 ; port DCMI_NRST
DCMI_PIXCK: J1.11 ; port DCMI_PIXCK
DCMI_PWREN: J1.17 ; port DCMI_PWR_EN
DCMI_SCL: J1.14 ; port DCMI_SCL
DCMI_SDA: J1.15 ; port DCMI_SDA
DCMI_VSYNC: J1.13 ; port DCMI_VSYNC
SPI_MISO: J1.19 ; port CAMERA_MISO
SPI_MOSI: J1.20 ; port CAMERA_MOSI
SPI_SCL: J1.18 ; port CAMERA_SCL

### Buses and harness runs
bus DCMI_D[0..7] = port DCMI_D[0..7]

### Notes on the sheet
- Title:
- Size:
- Project:
- Revision:
- Sheet
- of
- Date:
- YıLDıZ IoT
- Elperek Mahallesi
- Saray Sokak, No:12
- SAKARYA / TURKEY
- File:

### Library data of the parts
J1 = FPC-22: Connector; Manufacturer: Amphenol FCI; Actuator Material: Glass,Polyphenylene; Current Rating: 500mA; Voltage Rating: 50V; Contact Resistance: 30mR; Number of Positions: 22; Contact Location: Top; Insulation Resistance: 100MR; Wire/Cable Type: Straight; Pitch: 0.5mm; Supplier 1: Digi-Key; Supplier Part Number 1: 609-4319-1-ND; Manufacturer Part Number: SFV22R-2STE1HLF; Stock 1: 2152; Pricing 1: 1 = 0,79000, 10 = 0,74300, 25 = 0,66840, 50 = 0,59420, 100 = 0,56950, 250 = 0,52000, 500 = 0,49522, 1000 = 0,40856 (USD); RoHS: Yes; Mount: Surface Mount; Housing Color: Black; Contact Material: Bronze; Contact Plating: Tin; Housing Material: Polymer; Min Operating Temperature: -55°C; Max Operating Temperature: 105°C; Number of Rows: 1; Package Quantity: 3000; Packaging: Tape and Reel; Max Current Rating: 500mA; Termination: Solder; Number of Contacts: 22; Max Voltage Rating (AC): 50V; Orientation: Right Angle; Length: 16.5mm; Depth: 4.9mm; Radiation Hardening: No; Flammability Rating: UL94 V-0; ComponentLink1URL: https://datasheet.ciiva.com/670/10112793-670003.pdf?src-supplier=Digi-Key; ComponentLink1Description: https://datasheet.ciiva.com/670/10112793-670003.pdf?src-supplier=Digi-Key; ComponentLink2URL: https://datasheet.ciiva.com/670/10112793-670004.pdf?src-supplier=Digi-Key; ComponentLink2Description: https://datasheet.ciiva.com/670/10112793-670004.pdf?src-supplier=Digi-Key; ComponentLink3URL: https://datasheet.ciiva.com/13704/10112793-13704492.pdf?src-supplier=Mouser; ComponentLink3Description: https://datasheet.ciiva.com/13704/10112793-13704492.pdf?src-supplier=Mouser; ComponentLink4URL: https://datasheet.ciiva.com/670/10112793-670005.pdf?src-supplier=Digi-Key; ComponentLink4Description: https://datasheet.ciiva.com/670/10112793-670005.pdf?src-supplier=Digi-Key; ComponentLink5URL: https://datasheet.ciiva.com/10368/10112793-10368190.pdf?src-supplier=Avnet; ComponentLink5Description: https://datasheet.ciiva.com/10368/10112793-10368190.pdf?src-supplier=Avnet

## Sheet Connections.SchDoc: Expansion Connections
size A4; SheetNumber: 11; SheetTotal: 11; SheetSize: A4
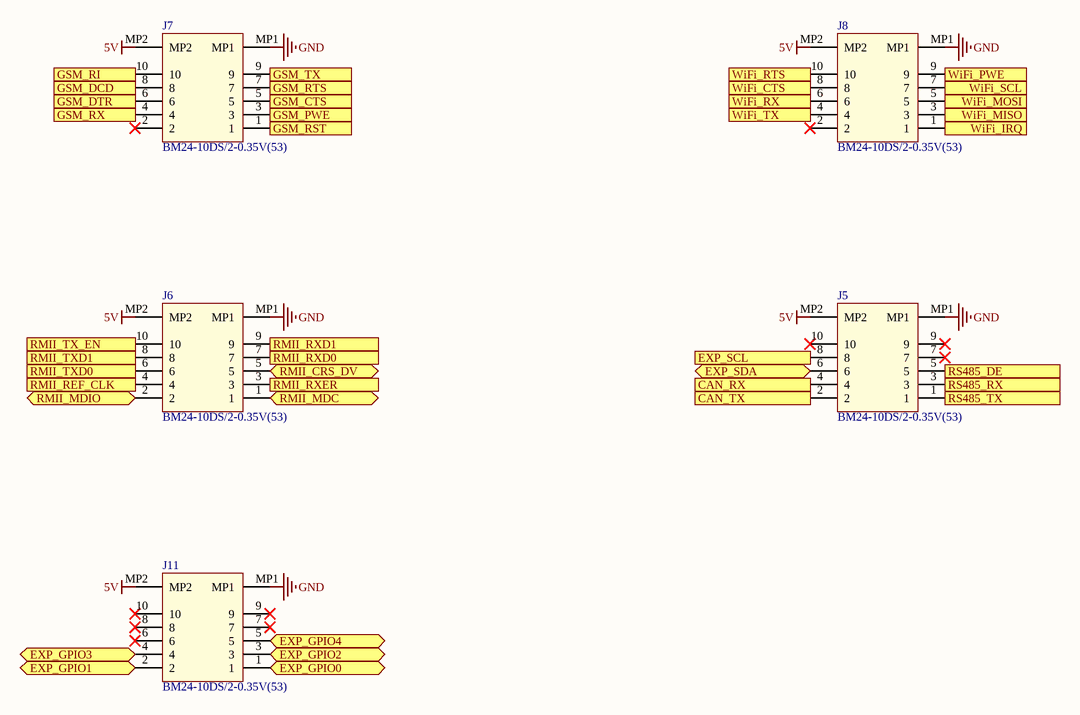
[diagram p5: Connections.SchDoc]

### Parts
J5  BM24-10DS/2-0.35V(53)  [HIROSE BM2410DS]
J6  BM24-10DS/2-0.35V(53)  [HIROSE BM2410DS]
J7  BM24-10DS/2-0.35V(53)  [HIROSE BM2410DS]
J8  BM24-10DS/2-0.35V(53)  [HIROSE BM2410DS]
J11  BM24-10DS/2-0.35V(53)  [HIROSE BM2410DS]

### Ports
CAN_RX (out), CAN_TX (in), EXP_GPIO0 (bidir), EXP_GPIO1 (bidir), EXP_GPIO2 (bidir), EXP_GPIO3 (bidir), EXP_GPIO4 (bidir), EXP_SCL (in), EXP_SDA (bidir), GSM_CTS (out), GSM_DCD (in), GSM_DTR (in), GSM_PWE (in), GSM_RI (out), GSM_RST (in), GSM_RTS (in), GSM_RX (out), GSM_TX (in), RMII_CRS_DV (bidir), RMII_MDC (bidir), RMII_MDIO (bidir), RMII_REF_CLK (in), RMII_RXD0 (out), RMII_RXD1 (out), RMII_RXER (out), RMII_TX_EN (in), RMII_TXD0 (in), RMII_TXD1 (in), RS485_DE (in), RS485_RX (out), RS485_TX (in), WiFi_CTS (out), WiFi_IRQ (out), WiFi_MISO (out), WiFi_MOSI (in), WiFi_PWE (in), WiFi_RTS (in), WiFi_RX (out), WiFi_SCL (in), WiFi_TX (in)

### Nets
5V: J5.MP2 J6.MP2 J7.MP2 J8.MP2 J11.MP2
GND: J5.MP1 J6.MP1 J7.MP1 J8.MP1 J11.MP1
NetJ5_1: J5.1 ; port RS485_TX
NetJ5_2: J5.2 ; port CAN_TX
NetJ5_3: J5.3 ; port RS485_RX
NetJ5_4: J5.4 ; port CAN_RX
NetJ5_5: J5.5 ; port RS485_DE
NetJ5_6: J5.6 ; port EXP_SDA
NetJ5_8: J5.8 ; port EXP_SCL
NetJ6_1: J6.1 ; port RMII_MDC
NetJ6_2: J6.2 ; port RMII_MDIO
NetJ6_3: J6.3 ; port RMII_RXER
NetJ6_4: J6.4 ; port RMII_REF_CLK
NetJ6_5: J6.5 ; port RMII_CRS_DV
NetJ6_6: J6.6 ; port RMII_TXD0
NetJ6_7: J6.7 ; port RMII_RXD0
NetJ6_8: J6.8 ; port RMII_TXD1
NetJ6_9: J6.9 ; port RMII_RXD1
NetJ6_10: J6.10 ; port RMII_TX_EN
NetJ7_1: J7.1 ; port GSM_RST
NetJ7_3: J7.3 ; port GSM_PWE
NetJ7_4: J7.4 ; port GSM_RX
NetJ7_5: J7.5 ; port GSM_CTS
NetJ7_6: J7.6 ; port GSM_DTR
NetJ7_7: J7.7 ; port GSM_RTS
NetJ7_8: J7.8 ; port GSM_DCD
NetJ7_9: J7.9 ; port GSM_TX
NetJ7_10: J7.10 ; port GSM_RI
NetJ8_1: J8.1 ; port WiFi_IRQ
NetJ8_3: J8.3 ; port WiFi_MISO
NetJ8_4: J8.4 ; port WiFi_TX
NetJ8_5: J8.5 ; port WiFi_MOSI
NetJ8_6: J8.6 ; port WiFi_RX
NetJ8_7: J8.7 ; port WiFi_SCL
NetJ8_8: J8.8 ; port WiFi_CTS
NetJ8_9: J8.9 ; port WiFi_PWE
NetJ8_10: J8.10 ; port WiFi_RTS
NetJ11_1: J11.1 ; port EXP_GPIO0
NetJ11_2: J11.2 ; port EXP_GPIO1
NetJ11_3: J11.3 ; port EXP_GPIO2
NetJ11_4: J11.4 ; port EXP_GPIO3
NetJ11_5: J11.5 ; port EXP_GPIO4

Not connected (* = marked no-connect by the designer): J5 7* 9* 10*; J7 2*; J8 2*; J11 6* 7* 8* 9* 10*

### Notes on the sheet
- Title:
- Size:
- Project:
- Revision:
- Sheet
- of
- Date:
- YıLDıZ IoT
- Elperek Mahallesi
- Saray Sokak, No:12
- SAKARYA / TURKEY
- File:

### Library data of the parts
J5-J8 J11 = 12 Pin (10 + 2 Power) B2B Socket: Board to Board Connector; Manufacturer: Hirose; Connector Type: Socket; Mated Stacking Heights: 0.8mm; Pitch: 0.014inch; Supplier 1: Digi-Key; Supplier Part Number 1: H124928CT-ND; Manufacturer Part Number: BM24-10DS/2-0.35V(53); Stock 1: 2056; Pricing 1: 1 = 1,05000, 10 = 0,92600, 25 = 0,87120, 50 = 0,83500, 100 = 0,79860, 250 = 0,72600, 500 = 0,65340 (USD); RoHS: Yes; Mount: Surface Mount; Number of Pins: 10; Contact Plating: Gold; Packaging: Tape and Reel; Number of Rows: 2; ComponentLink1URL: https://media.digikey.com/pdf/Data%20Sheets/Hirose%20PDFs/BM24.pdf?src-supplier=Digi-Key; ComponentLink1Description: https://media.digikey.com/pdf/Data%20Sheets/Hirose%20PDFs/BM24.pdf?src-supplier=Digi-Key; ComponentLink2URL: https://www.hirose.com/product/download/?distributor=digikey&type=2d&lang=en&num=BM24-10DS/2-0.35V(53)&src-supplier=Digi-Key; ComponentLink2Description: https://www.hirose.com/product/download/?distributor=digikey&type=2d&lang=en&num=BM24-10DS/2-0.35V(53)&src-supplier=Digi-Key; ComponentLink3URL: https://www.hirose.com/product/en/download_file/key_name/BM24-10DS__2-0.35V%2853%29/category/Specification%20Sheet/doc_file_id/87041/?file_category_id=9&item_id=06772002153&is_series=&src-supplier=Digi-Key; ComponentLink3Description: https://www.hirose.com/product/en/download_file/key_name/BM24-10DS__2-0.35V%2853%29/category/Specification%20Sheet/doc_file_id/87041/?file_category_id=9&item_id=06772002153&is_series=&src-supplier=Digi-Key

## Nets that join several sheets
3v3: Power (5 pins), QSPI FLASH (C9.1 IC3.8 R8.2), Paralel NOR FLASH (12 pins)
5V: Power (6 pins), LCD (J2.1), Camera (J1.1), Connections (5 pins)
GND: Power (15 pins), QSPI FLASH (C9.2 IC3.4), Paralel NOR FLASH (7 pins), LCD (5 pins), Camera (J1.10 J1.22 J1.MP1 J1.MP2), Connections (5 pins)